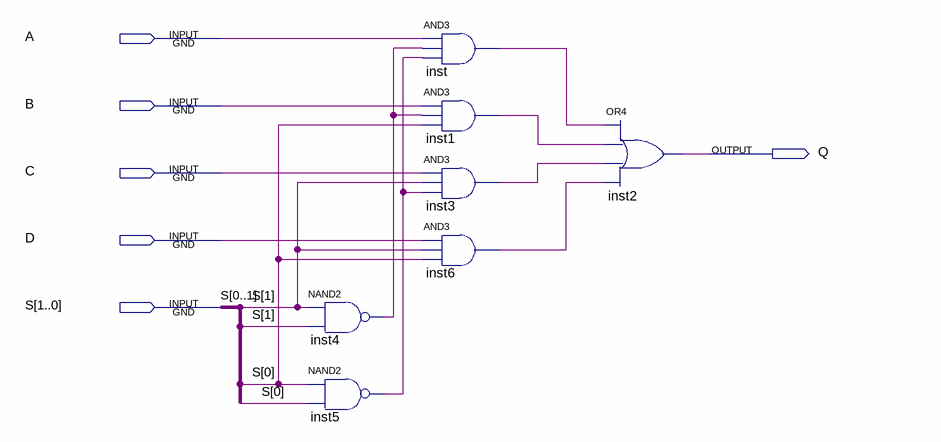
[diagram p0: schematic sheet]
// Quartus schematic Mux4p1.bdf as structural Verilog: 7 symbols, 6 pins
module Mux4p1 (
  input  A,
  input  B,
  input  C,
  input  D,
  input  [1:0] S,
  output Q
);

  wire inst1_out, inst3_out, inst4_out, inst5_out, inst6_out, inst_out;

  nand inst4 (inst4_out, S[1], S[1]);
  nand inst5 (inst5_out, S[0], S[0]);
  and inst (inst_out, A, inst4_out, inst5_out);
  and inst1 (inst1_out, B, inst4_out, S[0]);
  and inst3 (inst3_out, C, S[1], inst5_out);
  and inst6 (inst6_out, D, S[1], S[0]);
  or inst2 (Q, inst_out, inst1_out, inst3_out, inst6_out);
endmodule
